# Altium schematic sheet Chau_schematic.SchDoc
size A2; SheetNumber: 1; SheetTotal: 1
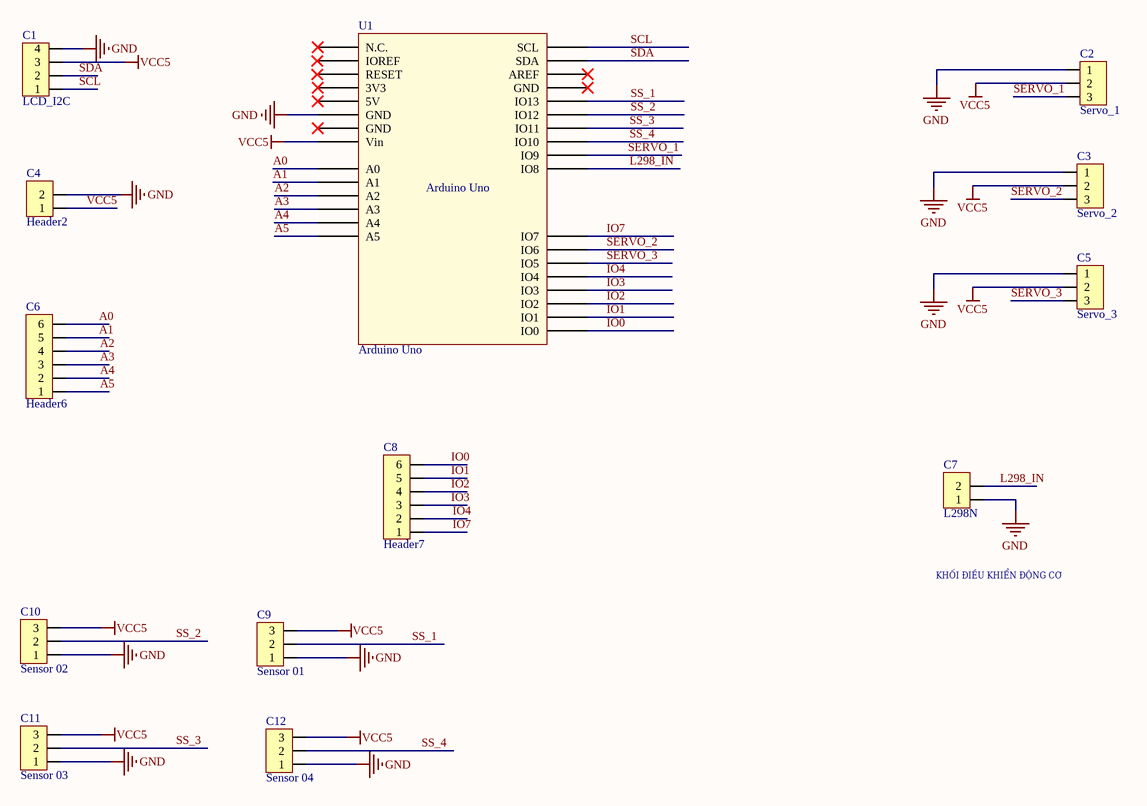
[diagram p0: Chau_schematic.SchDoc]

## Parts
C1  LCD_I2C  [Header4]
C2  Servo_1  [Header3]
C3  Servo_2  [Header3]
C4  Header2  [Header2]
C5  Servo_3  [Header3]
C6  Header6  [Header6]
C7  L298N  [Header2]
C8  Header7  [Header6]
C9  Sensor 01  [Header3]
C10  Sensor 02  [Header3]
C11  Sensor 03  [Header3]
C12  Sensor 04  [Header3]
U1  Arduino Uno  [Arduino Uno]

## Nets
GND: C1.4 C2.1 C3.1 C4.2 C5.1 C7.1 C9.1 C10.1 C11.1 C12.1 U1.GND1(GND)
VCC5: C1.3 C2.2 C3.2 C4.1 C5.2 C9.3 C10.3 C11.3 C12.3 U1.Vin
A0: C6.6 U1.A0
A1: C6.5 U1.A1
A2: C6.4 U1.A2
A3: C6.3 U1.A3
A4: C6.2 U1.A4
A5: C6.1 U1.A5
IO0: C8.6 U1.0(IO0)
IO1: C8.5 U1.1(IO1)
IO2: C8.4 U1.2(IO2)
IO3: C8.3 U1.3(IO3)
IO4: C8.2 U1.4(IO4)
IO7: C8.1 U1.7(IO7)
L298_IN: C7.2 U1.8(IO8)
SCL: C1.1 U1.SCL
SDA: C1.2 U1.SDA
SERVO_1: C2.3 U1.9(IO9)
SERVO_2: C3.3 U1.6(IO6)
SERVO_3: C5.3 U1.5(IO5)
SS_1: C9.2 U1.13(IO13)
SS_2: C10.2 U1.12(IO12)
SS_3: C11.2 U1.11(IO11)
SS_4: C12.2 U1.10(IO10)

Not connected (* = marked no-connect by the designer): U1 3V3* 5V* AREF* GND2(GND)* GND3(GND)* IOREF NC(N.C.)* RESET

## Notes on the sheet
- KHỐI ĐIỀU KHIỂN ĐỘNG CƠ

## Library data of the parts
C1 = Header4: Header IDC, 4 x 1 Pin Vertical 2.54mm Pitch (Non-Boxed, Male); Manufacturer: W¨¹rth Elektronik eiSos GmbH; partNo: 613002143121; ComponentLink1 Description: Manufacturer; ComponentLink2 Description: Datasheet; NoPins: 02; Created Date: 29 March 2013; ComponentLink1URL: http://www.we-online.com; ComponentLink2URL: http://katalog.we-online.de/em/datasheet/6130xx143121.pdf; Created by: Karrer Zheng
C2 C3 C5 C9-C12 = Header3: Header IDC, 3 x 1 Pin Vertical 2.54mm Pitch (Non-Boxed, Male); Manufacturer: W¨¹rth Elektronik eiSos GmbH; partNo: 613002143121; ComponentLink1 Description: Manufacturer; ComponentLink2 Description: Datasheet; NoPins: 02; Created Date: 29 March 2013; ComponentLink1URL: http://www.we-online.com; ComponentLink2URL: http://katalog.we-online.de/em/datasheet/6130xx143121.pdf; Created by: Karrer Zheng
C4 C7 = Header2: Header IDC, 2 x 1 Pin Vertical 2.54mm Pitch (Non-Boxed, Male); Manufacturer: W¨¹rth Elektronik eiSos GmbH; partNo: 613002143121; ComponentLink1 Description: Manufacturer; ComponentLink2 Description: Datasheet; NoPins: 02; Created Date: 29 March 2013; ComponentLink1URL: http://www.we-online.com; ComponentLink2URL: http://katalog.we-online.de/em/datasheet/6130xx143121.pdf; Created by: Karrer Zheng
C6 C8 = Header6: Header IDC, 6 x 1 Pin Vertical 2.54mm Pitch (Non-Boxed, Male); Manufacturer: W¨¹rth Elektronik eiSos GmbH; partNo: 613002143121; ComponentLink1 Description: Manufacturer; ComponentLink2 Description: Datasheet; NoPins: 02; Created Date: 29 March 2013; ComponentLink1URL: http://www.we-online.com; ComponentLink2URL: http://katalog.we-online.de/em/datasheet/6130xx143121.pdf; Created by: Karrer Zheng